# EAGLE schematic 1278-Micro-v2 - kopia (EAGLE 9.6.2)
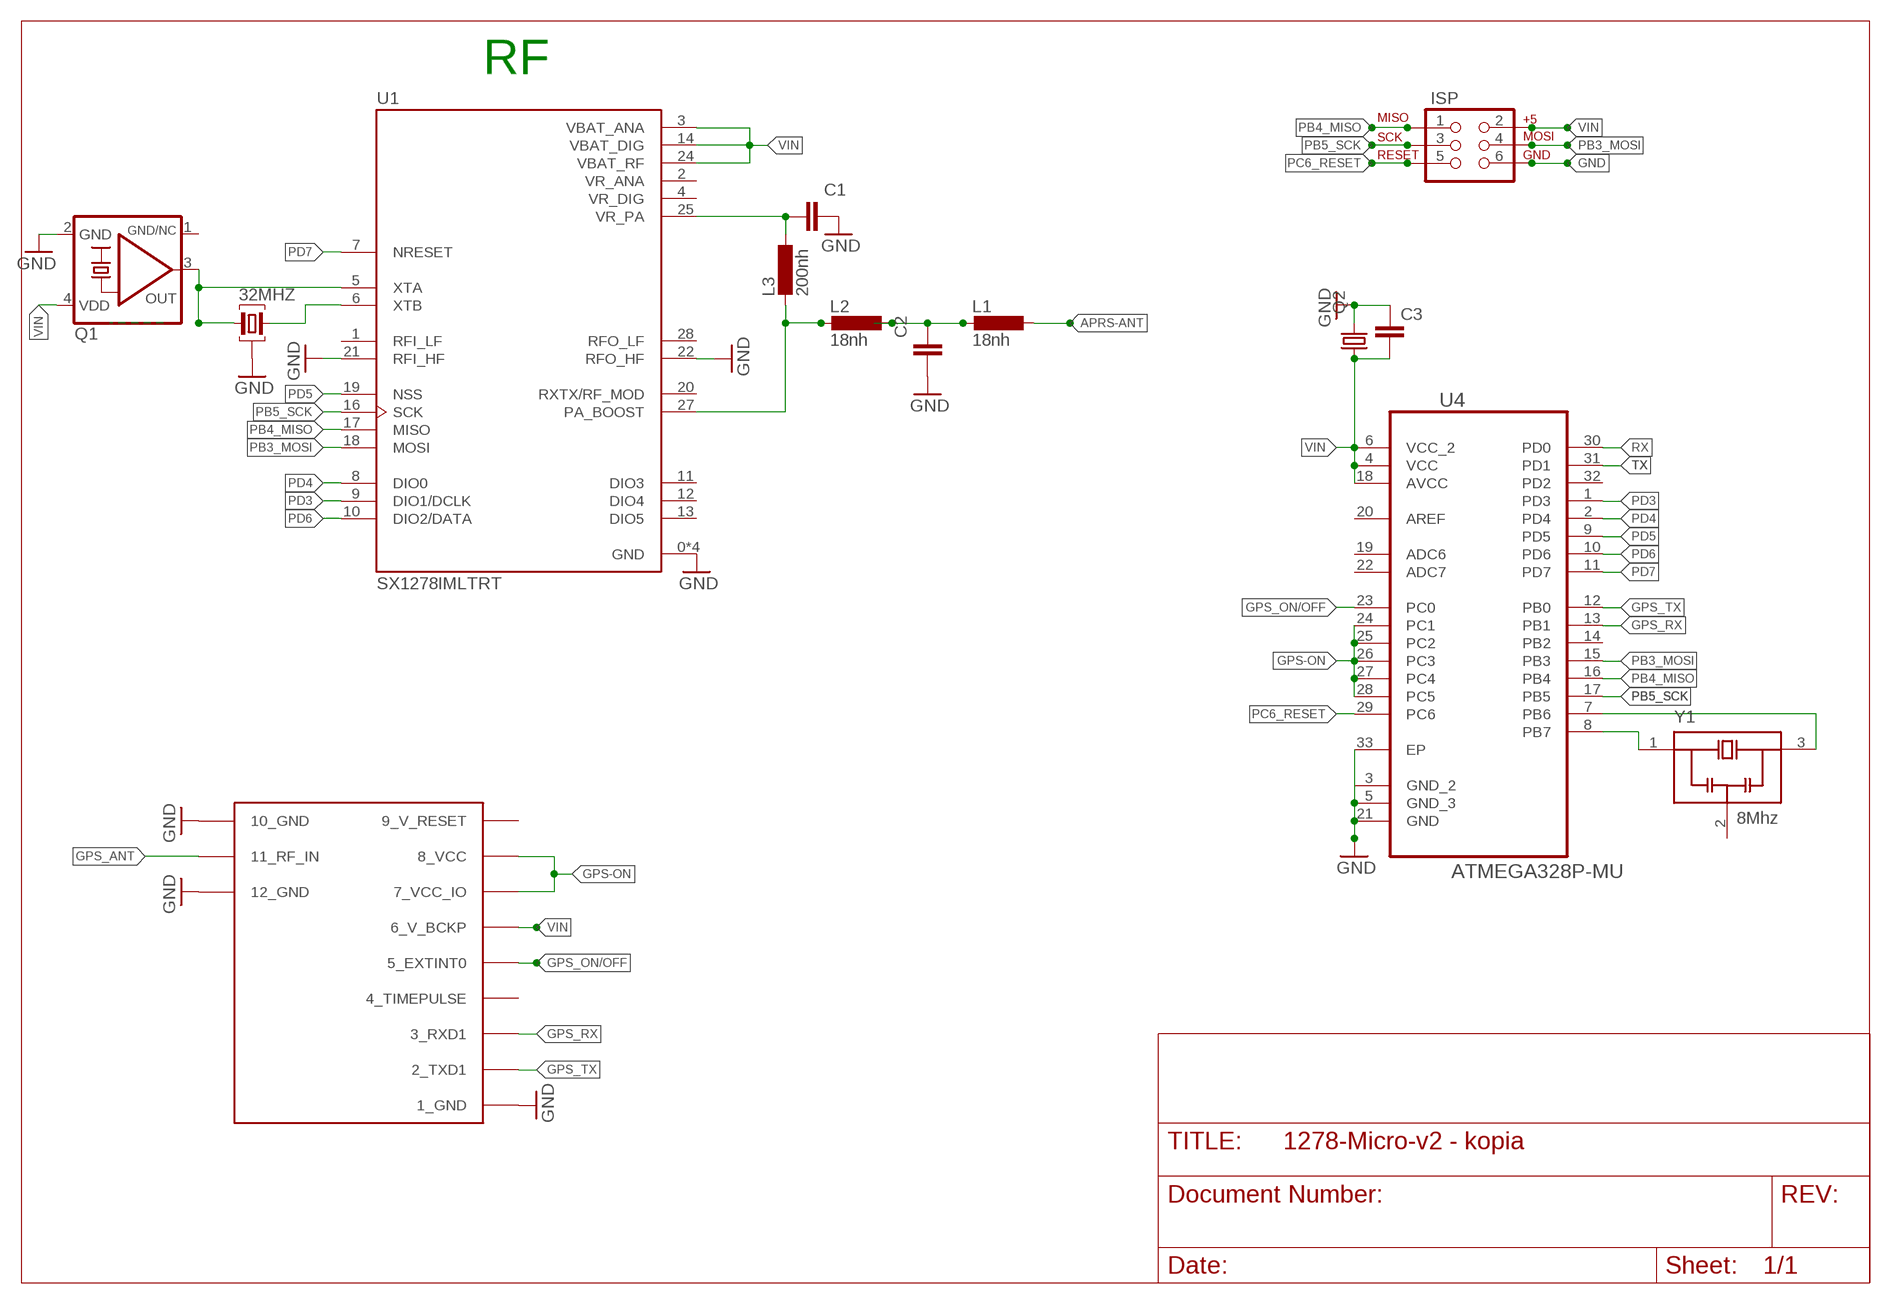
[diagram p0: schematic, sheet 1]

## Parts
32MHZ  16Mhz  ABM8G  [ABM8G]
C1  100nF  C-EUC0603K  [C0603K]
C2  15pF  C-EUC0603K  [C0603K]
C3  C-EUC1808  [C1808]
ISP  AVR_SPI_PRG_6PTH  [2X3]
L1  18nh  L-EUL2012C  [L2012C]
L2  18nh  L-EUL2012C  [L2012C]
L3  200nh  L-EUL2012C  [L2012C]
Q1  TCXO 32Mhz  KXO-TCXO-CMOS-84  [3.2X2.5_KXO-84-TCXO]
Q2  KX-327-NHF  [3.2X1.5]
U1  SX1278IMLTRT  [QFN65P600X600X100-29N]
U4  ATMEGA328P-MU  [QFN50P500X500X100-33N]
U$2  UBLOX_MAX  [UBLOX_MAX]
Y1  8Mhz  CSTCE12M0G15L08-R0  [OSC_CSTCE12M0G15L08-R0]

## Nets
AAA: 32MHZ.1 Q1.3(OUT) U1.5(XTA)
APRS-ANT: L1.1
GND: 32MHZ.2 32MHZ.4 C1.2 C2.1 C3.1 ISP.6 Q1.2(GND) Q2.2 U1.0(GND) U1.15(GND) U1.21(RFI_HF) U1.22(RFO_HF) U1.23(GND) U1.26(GND) U4.3(GND_2) U4.5(GND_3) U4.21(GND) U4.33(EP) U$2.1_GND U$2.10_GND U$2.12_GND
GPS-ON: U4.24(PC1) U4.25(PC2) U4.26(PC3) U4.27(PC4) U4.28(PC5) U$2.7_VCC_IO U$2.8_VCC
GPS_ANT: U$2.11_RF_IN
GPS_ON/OFF: U4.23(PC0) U$2.5_EXTINT0
GPS_RX: U4.13(PB1) U$2.3_RXD1
GPS_TX: U4.12(PB0) U$2.2_TXD1
N$1: U4.7(PB6) Y1.3(OUT)
N$2: U4.8(PB7) Y1.1(IN)
N$3: C2.2 L1.2 L2.1
N$8: C1.1 L3.1 U1.25(VR_PA)
N$9: L2.2 L3.2 U1.27(PA_BOOST)
N$15: 32MHZ.3 U1.6(XTB)
PB3_MOSI: ISP.4 U1.18(MOSI) U4.15(PB3)
PB4_MISO: ISP.1 U1.17(MISO) U4.16(PB4)
PB5_SCK: ISP.3 U1.16(SCK) U4.17(PB5)
PC6_RESET: ISP.5 U4.29(PC6)
PD3: U1.9(DIO1/DCLK) U4.1(PD3)
PD4: U1.8(DIO0) U4.2(PD4)
PD5: U1.19(NSS) U4.9(PD5)
PD6: U1.10(DIO2/DATA) U4.10(PD6)
PD7: U1.7(NRESET) U4.11(PD7)
RX: U4.30(PD0)
TX: U4.31(PD1)
VIN: C3.2 ISP.2 Q1.4(VDD) Q2.1 U1.3(VBAT_ANA) U1.14(VBAT_DIG) U1.24(VBAT_RF) U4.4(VCC) U4.6(VCC_2) U4.18(AVCC) U$2.6_V_BCKP
Unconnected: U1.1(RFI_LF) U1.11(DIO3) U1.12(DIO4) U1.13(DIO5) U1.20(RXTX/RF_MOD) U1.28(RFO_LF) U4.14(PB2) U4.19(ADC6) U4.20(AREF) U4.22(ADC7) U4.32(PD2) U$2.4_TIMEPULSE

## Notes on the sheet
- RF

## Power pins joined to a net without a drawn wire
9_V_RESET: U$2.9_V_RESET
GND: Y1.2(GND)
GND/NC: Q1.1(GND/NC)
VR_ANA: U1.2(VR_ANA)
VR_DIG: U1.4(VR_DIG)

## Library data of the parts
32MHZ = crystal:ABM8G: CRYSTAL - ABRACON ABM8G Series, 3.2 x 2.5 mm
C1 C2 = rcl:C-EU: CAPACITOR, European symbol; SPICEPREFIX: C
C3 = resistor:C-EU: CAPACITOR, European symbol
ISP = SparkFun:AVR_SPI_PRG_6: AVR ISP 6 Pin This is the reduced ISP connector for AVR programming. Common on Arduino. This footprint will take up less PCB space and can be used with a 10-pin to 6-pin adapter such as SKU: BOB-08508
L1-L3 = resistor:L-EU: INDUCTOR, European symbol
Q1 = crystal-geyer_V1_0:KXO-TCXO-CMOS: TCXO : CMOS - Serie Model Size l/w/h [mm] Frequency Range Frequency Stability Temp. Range [°C] Output AECQ 200 availabel Datasheet KXO-86 KXO-84 KXO-83 KXO-82 2.5/2.0/0.7 3.2/2.5/1.0 5.0/3.2/1.5 7.0/5.0/2.4 13,0 ~ 40,0 MHz 10,0 ~ 40,0 MHz 10,0 ~ 40,0 MHz 10,0 ~ 30,0 MHz ±1,0 … ±2,5ppm ±1,0 … ±2,5ppm ±1,0 … ±3,0ppm ±1,0 … ±3,0ppm (*) -30°C …+75°C (*) -40°C …+85°C (*) -40°C …+85°C (*) -30°C …+80°C CMOS CMOS CMOS CMOS - - - - KXO-86.pdf <http://www.geyer-electronic.de/uploads/tx_userartikelfrequenz/GEYER-KXO-86-TCXO-HCMOS.pdf> KXO-84.pdf <http://www.geyer-electronic.de/uploads/tx_userartikelfrequenz/GEYER-KXO-84-TCXO-HCMOS.pdf> KXO-83.pdf <http://www.geyer-electronic.de/uploads/tx_userartikelfrequenz/GEYER-KXO-83-TCXO-HCMOS.pdf> KXO-82.pdf <http://www.geyer-electronic.de/uploads/tx_userartikelfrequenz/GEYER-KXO-82-TCXO-HCMOS.pdf> <http://www.geyer-electronic.de/fileadmin/template/img/logo-geyer-electronic.png> Details see: http://www.geyer-electronic.de/Frequenz-Produkte.9.0.html Created 2016-06-07, Hans Locher 2016 (C) Geyer Quartz Technology KXO86,KXO84,KXO83,KXO82;2550;3225;5032;7050;2,5x2,0;3,2x2,5;2.5x2.0;3.2x2.5,5,0x3,2;7,0x5,0,5.0x3.2,7.0x5.0
Q2 = crystal-geyer_V1_0:KX-327: Tuning Fork Crystals (kHz) SMD: KX327 - Serie Model Size l/w/h [mm] Frequency Range Frequency Stability Temp. Range [°C] Load Capacitance AECQ 200 availabel Datasheet KX-327VT KX-327FT KX-327RT KX-327NHT KX-327NHF KX-327L KX-327S 1.25/1.05/0.5 1.6/1.0/0.5 2.0/1.2/0.6 3.2/1.5/0.8 3.2/1.5/0.8 7.0/1.5/1.4 8.2/3.8/2.5 32,768 kHz 32,768 kHz 32,768 kHz 32,768 kHz 32,768 kHz 32,768 kHz 32,768 kHz ±10 … ±20ppm ±10 … ±20ppm ±10 … ±20ppm ±10 … ±20ppm ±10 … ±20ppm ±10 … ±20ppm ±5 … ±20ppm (*) -40°C …+85°C (*) -40°C …+85°C (*) -40°C …+85°C (*) -40°C …+85°C (*) -40°C …+125°C (*) -40°C …+85°C (*) -40°C …+85°C 7/9/12,5 7/9/12,5 7/9/12,6 7/9/12,5 9/12,5 7/9/12,5 6/12,5 - - - - yes - - KX-327VT.pdf <http://www.geyer-electronic.de/uploads/tx_userartikelfrequenz/GEYER-KX-327VT.pdf> KX-327FT.pdf <http://www.geyer-electronic.de/uploads/tx_userartikelfrequenz/GEYER-KX-327FT.pdf> KX-327RT.pdf <http://www.geyer-electronic.de/uploads/tx_userartikelfrequenz/GEYER-KX-327RT.pdf> KX-327NHT.pdf <http://www.geyer-electronic.de/uploads/tx_userartikelfrequenz/GEYER-KX-327NHT.pdf> KX-327NHF.pdf <http://www.geyer-electronic.de/uploads/tx_userartikelfrequenz/GEYER-KX-327NHF.pdf> KX-327L.pdf <http://www.geyer-electronic.de/uploads/tx_userartikelfrequenz/GEYER-KX-327L.pdf> KX-327S.pdf <http://www.geyer-electronic.de/uploads/tx_userartikelfrequenz/GEYER-KX-327S.pdf> <http://www.geyer-electronic.de/fileadmin/template/img/logo-geyer-electronic.png> Details see: http://www.geyer-electronic.de/Frequenz-Produkte.9.0.html Created 2016-06-07, Hans Locher 2016 (C) Geyer Quartz Technology KX327VT,KX327FT,KX327RT,KX327NHT,KX327NHF,KX327S,KX327L;125105;1610;2012;3215;7015;8238;1,25x1,05,1.25x1.05;1,6x1,0,1.6x1.0;2,0x1,2,2.0x1.2;3,2x1,5,3.2x1.5;8,2x3,8,8.2x3.8,7.0x1.5,7,0x1,532.768kHz
U1 = SX1278IMLTRT:SX1278IMLTRT; DESCRIPTION: IC RF TxRx Only 802.15.4 LoRa™ 137MHz ~ 525MHz 28-VQFN Exposed Pad; DIGI-KEY_PART_NUMBER: SX1278IMLTRTCT-ND; MF: Semtech; MP: SX1278IMLTRT; PACKAGE: VQFN-28 Semtech
U4 = ava:ATMEGA328P-MU: Programmable Flash; MPN: ATMEGA328P-MU; OC_FARNELL: 1748522; OC_NEWARK: 26R2526; PACKAGE: QFN-32; SUPPLIER: Atmel
U$2 = Max gps:UBLOX_MAX: UBLOX MAX
Y1 = CSTCE12M0G15L08-R0:CSTCE12M0G15L08-R0: 8MHz Ceramic Resonator Built in Capacitor 10pF +/- 0.2% -40C - 125C Surface Mount Check prices <https://pricing.snapeda.com/parts/CSTCE12M0G15L08-R0/Murata/view-part?ref=eda>; AVAILABILITY: Not in stock; DESCRIPTION: CSTCE Series 12 MHz 3.2 x 1.3 x 0.7 mm Built-in Capacitor SMT Resonator; MF: Murata; MP: CSTCE12M0G15L08-R0; PACKAGE: SMD-3 Murata; PRICE: None

## Net classes
0 default: width 0.203 mm
1 vcc: width 0.152 mm, clearance 0.152 mm